# EAGLE design PulseFit (EAGLE 7.3.0)
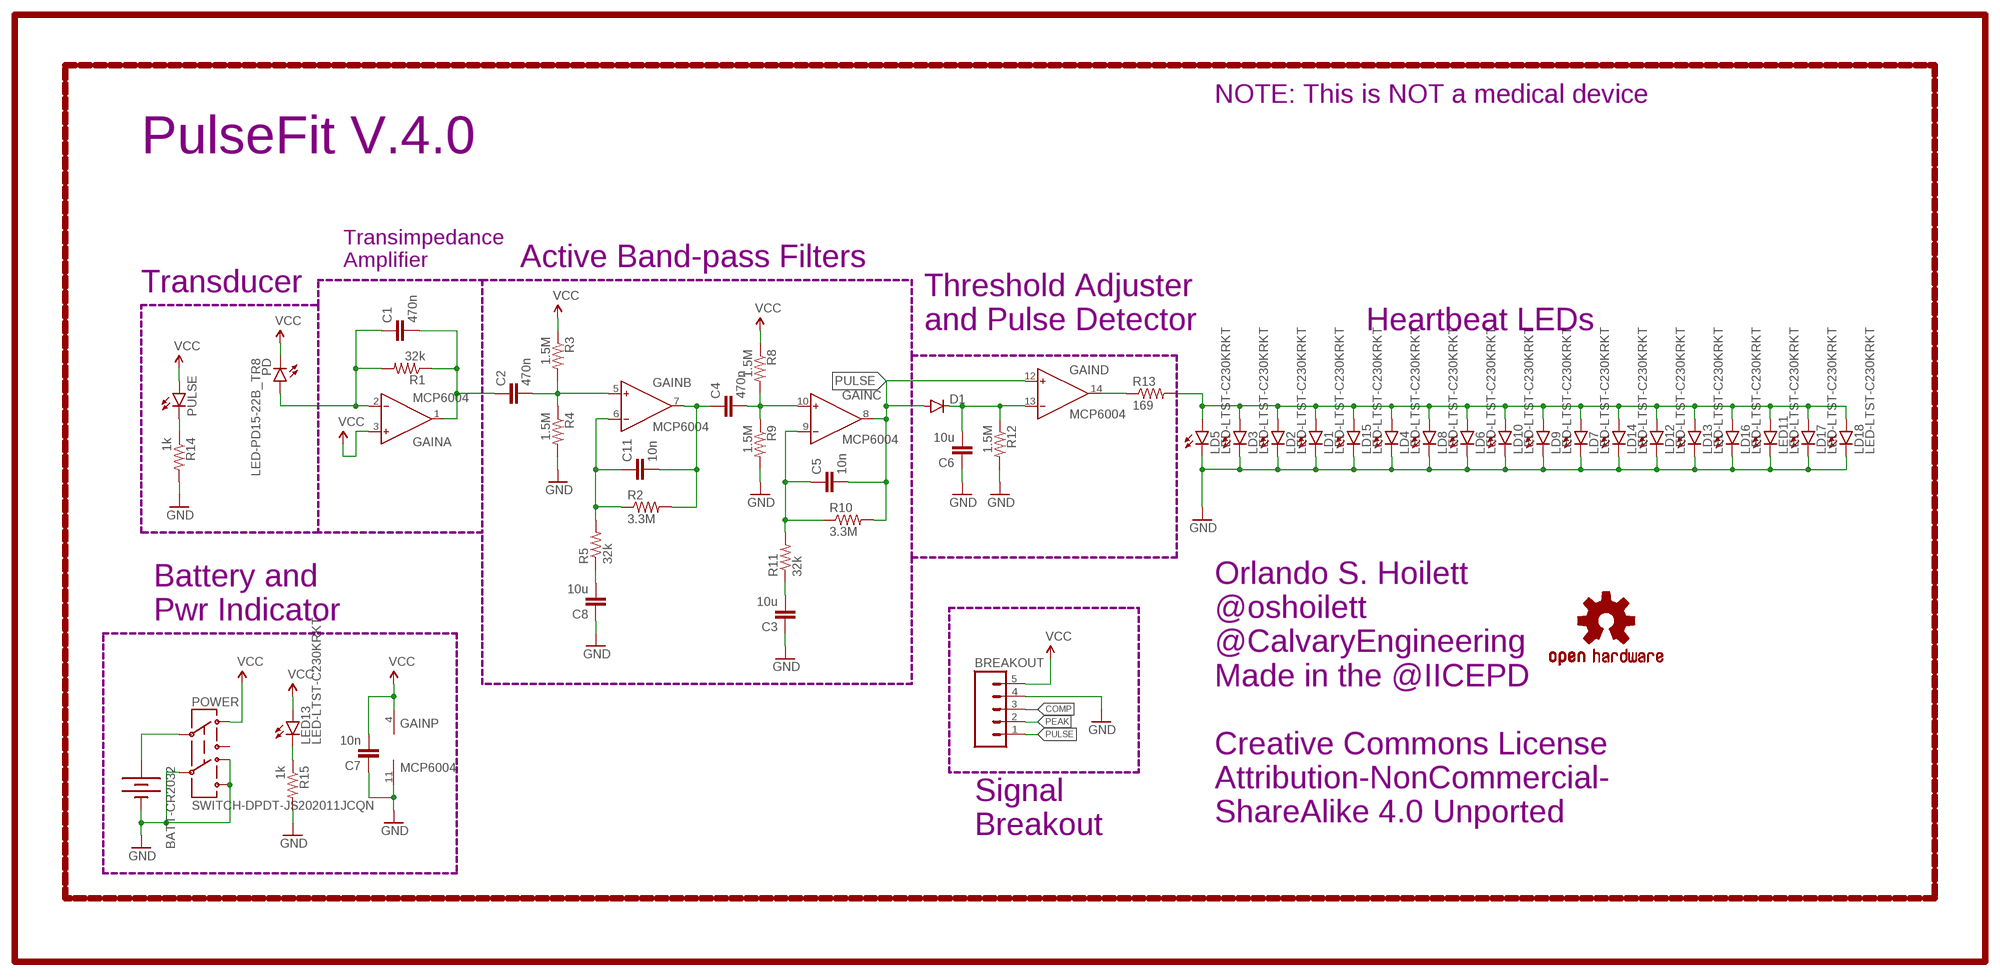
[diagram p0: schematic, sheet 1]

## Parts
BATT-CR2032  BATTERY20SMD  [BATTCON_20MM]
BREAKOUT  M05NO_SILK  [1X05_NO_SILK]
C1  470n  C-EUC0402  [C0402]
C2  470n  C-EUC0402  [C0402]
C3  10u  C-EUC0805  [C0805]
C4  470n  C-EUC0402  [C0402]
C5  10n  C-EUC0402  [C0402]
C6  10u  C-EUC0805  [C0805]
C7  10n  C-EUC0402  [C0402]
C8  10u  C-EUC0805  [C0805]
C11  10n  C-EUC0402  [C0402]
D1  250mA/100V  DIODEBAS16  [SOD-323]
GAIN  MCP6004  AD8609RU  [TSSOP14]
LD1  LED-LTST-C230KRKT  [LED-1206-BOTTOM]
LD2  LED-LTST-C230KRKT  [LED-1206-BOTTOM]
LD3  LED-LTST-C230KRKT  [LED-1206-BOTTOM]
LD4  LED-LTST-C230KRKT  [LED-1206-BOTTOM]
LD5  LED-LTST-C230KRKT  [LED-1206-BOTTOM]
LD6  LED-LTST-C230KRKT  [LED-1206-BOTTOM]
LD7  LED-LTST-C230KRKT  [LED-1206-BOTTOM]
LD8  LED-LTST-C230KRKT  [LED-1206-BOTTOM]
LD9  LED-LTST-C230KRKT  [LED-1206-BOTTOM]
LD10  LED-LTST-C230KRKT  [LED-1206-BOTTOM]
LD12  LED-LTST-C230KRKT  [LED-1206-BOTTOM]
LD13  LED-LTST-C230KRKT  [LED-1206-BOTTOM]
LD14  LED-LTST-C230KRKT  [LED-1206-BOTTOM]
LD15  LED-LTST-C230KRKT  [LED-1206-BOTTOM]
LD16  LED-LTST-C230KRKT  [LED-1206-BOTTOM]
LD17  LED-LTST-C230KRKT  [LED-1206-BOTTOM]
LD18  LED-LTST-C230KRKT  [LED-1206-BOTTOM]
LED11  LED-LTST-C230KRKT  [LED-1206-BOTTOM]
LED13  LED-LTST-C230KRKT  [LED-1206-BOTTOM]
LOGO1  OSHW-LOGOS  [OSHW-LOGO-S]
PD  LED-PD15-22B_TR8  [LED-PD15-22B_TR8]
POWER  SWITCH-DPDT-JS202011JCQN  [J-LEAD]
PULSE  LED0603  [LED-0603]
R1  32k  R-US_R0402  [R0402]
R2  3.3M  R-US_R0402  [R0402]
R3  1.5M  R-US_R0402  [R0402]
R4  1.5M  R-US_R0402  [R0402]
R5  32k  R-US_R0402  [R0402]
R8  1.5M  R-US_R0402  [R0402]
R9  1.5M  R-US_R0402  [R0402]
R10  3.3M  R-US_R0402  [R0402]
R11  32k  R-US_R0402  [R0402]
R12  1.5M  R-US_R0402  [R0402]
R13  169  R-US_R0402  [R0402]
R14  1k  R-US_R0402  [R0402]
R15  1k  R-US_R0402  [R0402]

## Nets
ANODE: LD1.A LD2.A LD3.A LD4.A LD5.A LD6.A LD7.A LD8.A LD9.A LD10.A LD12.A LD13.A LD14.A LD15.A LD16.A LD17.A LD18.A LED11.A R13.2
COMP: BREAKOUT.3 GAIN.14(D:OUT) R13.1
GND: BATT-CR2032.2(-) BREAKOUT.4 C3.1 C6.1 C7.1 C8.1 GAIN.11(P:V-) LD1.C LD2.C LD3.C LD4.C LD5.C LD6.C LD7.C LD8.C LD9.C LD10.C LD12.C LD13.C LD14.C LD15.C LD16.C LD17.C LD18.C LED11.C POWER.4 POWER.5 POWER.6 R4.2 R9.2 R12.2 R14.2 R15.2
N$1: C1.1 GAIN.2(A:IN-) PD.A-1(A) PD.A-2(A) R1.2
N$2: C1.2 C2.1 GAIN.1(A:OUT) R1.1
N$3: C4.2 GAIN.10(C:IN+) R8.2 R9.1
N$4: C2.2 GAIN.5(B:IN+) R3.2 R4.1
N$5: BATT-CR2032.1(+) POWER.2
N$6: C3.2 R11.1
N$8: C5.1 GAIN.9(C:IN-) R10.1 R11.2
N$9: PULSE.C R14.1
N$10: C11.1 GAIN.6(B:IN-) R2.1 R5.2
N$11: C4.1 C11.2 GAIN.7(B:OUT) R2.2
N$12: LED13.C R15.1
N$14: C8.2 R5.1
PEAK: BREAKOUT.2 C6.2 D1.C GAIN.13(D:IN-) R12.1
PULSE: BREAKOUT.1 C5.2 D1.A GAIN.8(C:OUT) GAIN.12(D:IN+) R10.2
VCC: BREAKOUT.5 C7.2 GAIN.3(A:IN+) GAIN.4(P:V+) LED13.A PD.C-1(C) PD.C-2(C) POWER.1 PULSE.A R3.1 R8.1
Unconnected: POWER.3

## Notes on the sheet
- NOTE: This is NOT a medical device
- PulseFit V.4.0
- Transimpedance
  Amplifier
- Active Band-pass Filters
- Transducer
- Threshold Adjuster
  and Pulse Detector
- Heartbeat LEDs
- Battery and
  Pwr Indicator
- Orlando S. Hoilett
  @oshoilett
  @CalvaryEngineering
  Made in the @IICEPD
  
  Creative Commons License
  Attribution-NonCommercial-
  ShareAlike 4.0 Unported
- Signal
  Breakout

## Library data of the parts
BATT-CR2032 = SparkFun-Electromechanical:BATTERY: Battery Holders Various common sizes : AA, AAA, 18650 (PRT-12895), 20mm coin cell and 12mm coin cell. 20MM_4LEGS, BATT-10373
BREAKOUT = SparkFun-Connectors:M05: Header 5 Standard 5-pin 0.1" header. Use with straight break away headers (SKU : PRT-00116), right angle break away headers (PRT-00553), swiss pins (PRT-00743), machine pins (PRT-00117), and female headers (PRT-00115). Molex polarized connector foot print use with SKU : PRT-08230 with associated crimp pins and housings.
C1-C8 C11 = resistor:C-EU: CAPACITOR, European symbol
D1 = SparkFun-DiscreteSemi:DIODE: Diode These are standard reverse protection diodes and small signal diodes. SMA package can handle up to about 1A. SOD-323 can handle about 200mA. What the SOD-323 package when ordering, there are some mfgs out there that are 5-pin packages.; PROD_ID: DIO-09646
GAIN = analog-devices:AD8609: Precision Micropower, Low Noise CMOS, Rail-to-Rail Input/Output Operational Amplifiers Source: http://www.analog.com/static/imported-files/data_sheets/AD8603_8607_8609.pdf; MF: ALTERA CORPORATION; MPN: AD8609ARUZ; OC_FARNELL: 1464994; OC_NEWARK: 59K6934
LD1-LD10 LD12-LD18 LED11 LED13 = Orlando:LED-LTST-C230KRKT
LOGO1 = SparkFun-Aesthetics:OSHW-LOGO: Open Source Hardware Logo This logo indicates the piece of hardware it is found on incorporates a OSHW license and/or adheres to the definition of open source hardware found here: http://freedomdefined.org/OSHW
PD = Orlando:LED-PD15-22B_TR8
POWER = SparkFun-Electromechanical:SWITCH-DPDT-JS202011JCQN
PULSE = SparkFun-LED:LED: LEDs Standard schematic elements and footprints for 5mm, 3mm, 1206, and 0603 sized LEDs. 5mm - Spark Fun Electronics SKU : COM-00529 (and others)
R1-R5 R8-R15 = resistor:R-US_: RESISTOR, American symbol

## Board
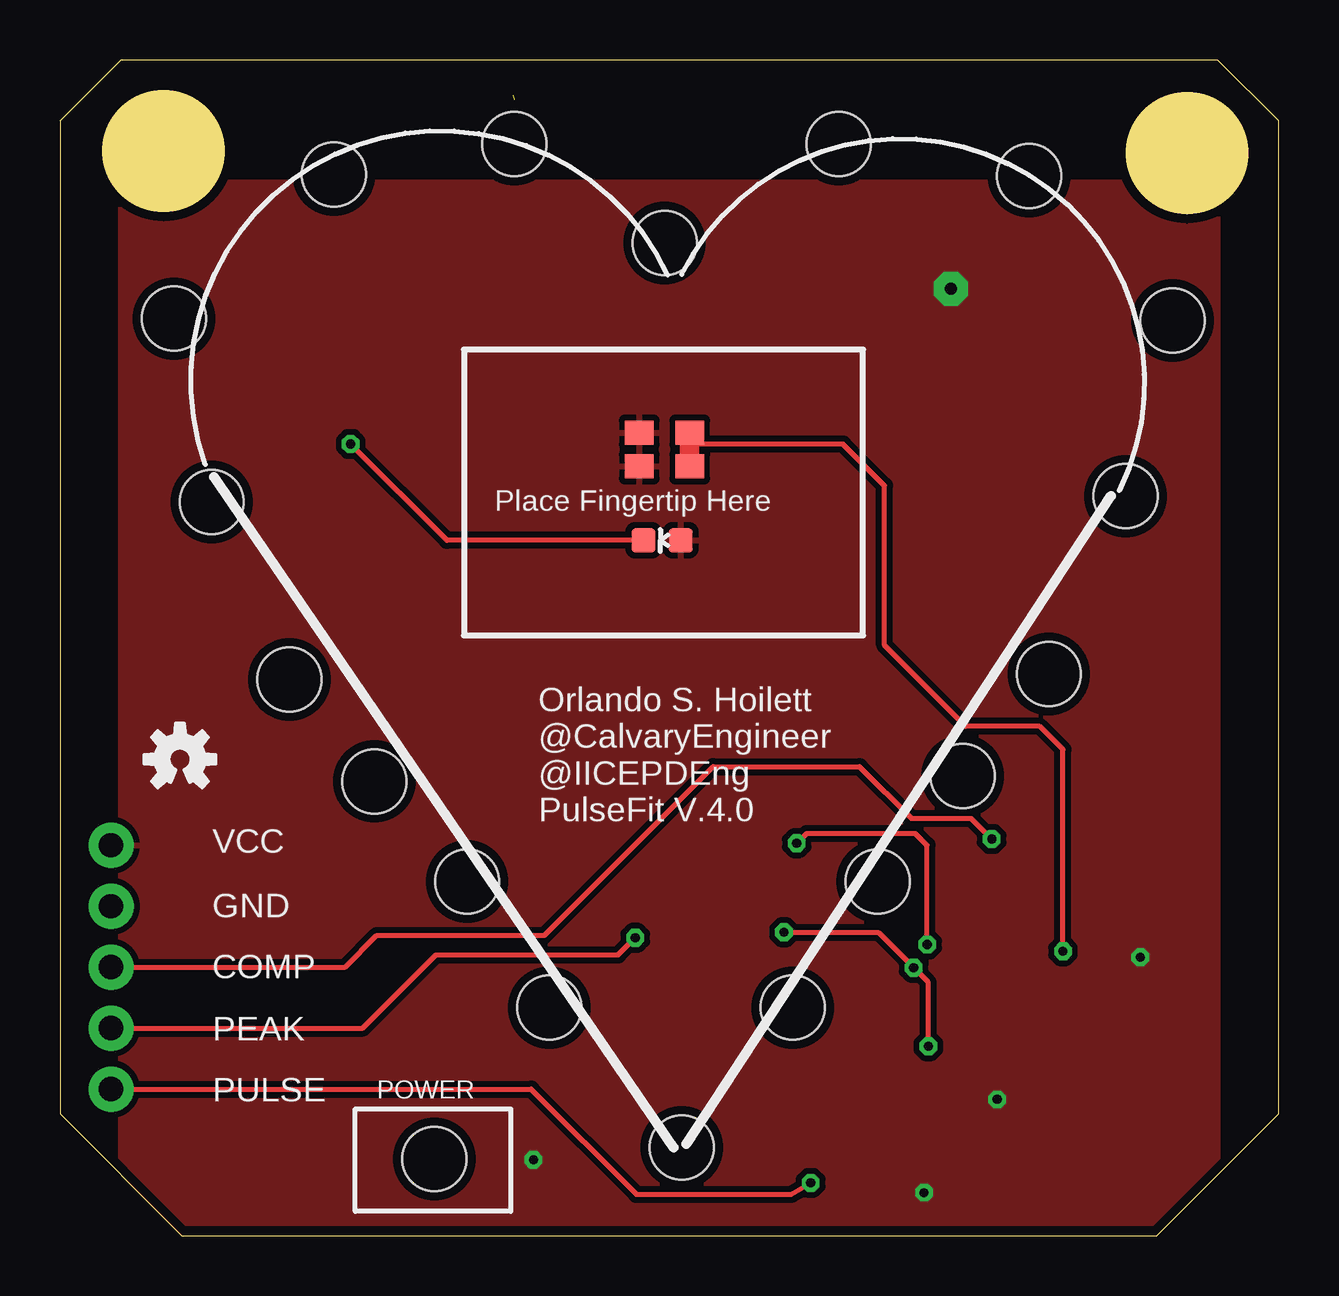
[diagram p1: board, top side]
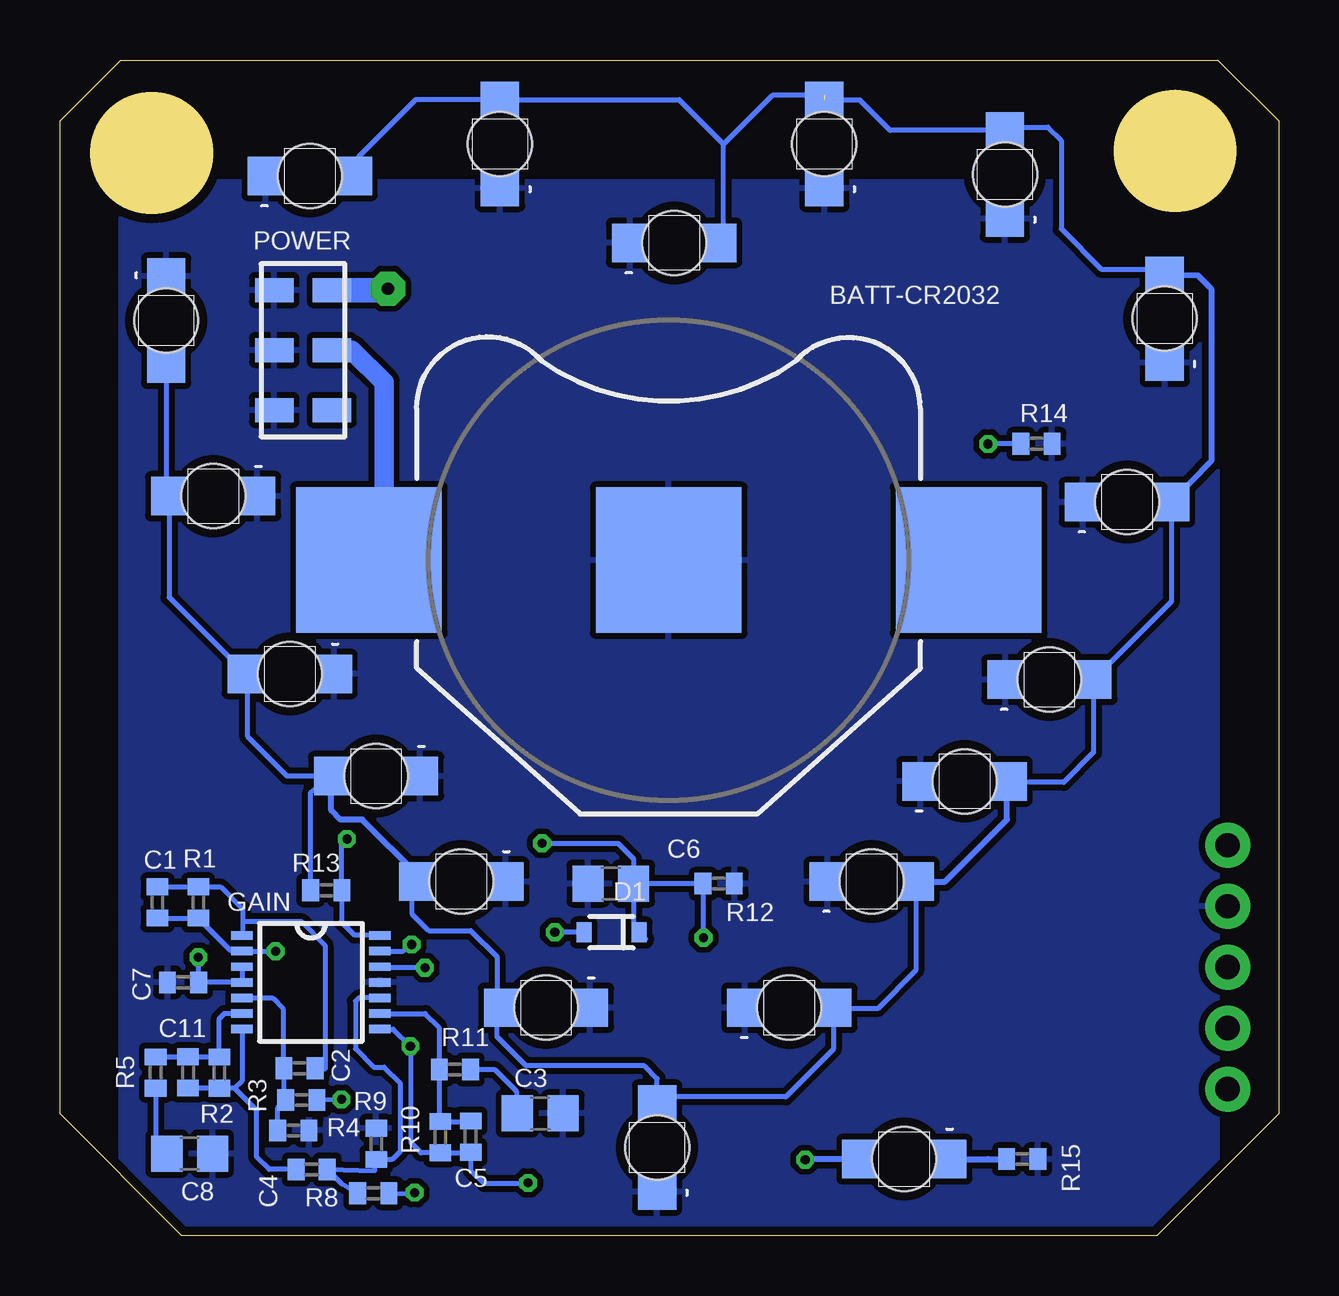
[diagram p2: board, bottom side, seen from below]

Size 50.8 x 49 mm. Coordinates in mm from the lower left corner, seen from the top.
Outline: 4.29,45.21 4.34,45.21
Outline: 46.95,45.12 47,45.12
Outline: 5.08,0 45.72,0 50.8,5.08 50.8,46.46 48.26,49 2.54,49 0,46.46 0,5.08 5.08,0
Copper layers (1*16): Top 0.0356mm / dielectric 1.5011mm / Bottom 0.0356mm
Design rules "LaenPCBOrder": minimum track width 6mil, minimum drill 13mil, track to track 6mil, track to pad 6mil, pad to pad 6mil, via to via 6mil, smd to smd 6mil, copper to edge 15mil, drill to drill 6mil, minimum pad ring 7mil, minimum via ring 7mil, stop-mask expansion 3mil, vias tented up to drill 0mil, thermal gap 10mil

### Footprints (pad centres in the part's own frame; a part is rotated, then mirrored left to right if it is on the bottom)
BATTCON_20MM = smd 6.07 x 6.07: 1 -12.5,0; 2 0,0; 3 12.5,0
1X05_NO_SILK = drill 1.016 pad 1.88: 1 0,0; 2 2.54,0; 3 5.08,0; 4 7.62,0; 5 10.16,0
C0402 = smd 0.7 x 0.9: 1 -0.65,0; 2 0.65,0
C0805 = smd 1.3 x 1.5: 1 -0.95,0; 2 0.95,0
SOD-323 = smd 0.63 x 0.83: A 1.15,0; C -1.15,0
TSSOP14 = smd 0.9 x 0.35: 1 -2.875,1.95; 2 -2.875,1.3; 3 -2.875,0.65; 4 -2.875,0; 5 -2.875,-0.65; 6 -2.875,-1.3; 7 -2.875,-1.95; 8 2.875,-1.95; 9 2.875,-1.3; 10 2.875,-0.65; 11 2.875,0; 12 2.875,0.65; 13 2.875,1.3; 14 2.875,1.95
LED-1206-BOTTOM = smd 1.5 x 1.6: A -1.841,0; C 1.841,0 | hole 2.667: 0,0
LED-PD15-22B_TR8 = smd 1.2 x 1: A-1 -1.05,0.7; A-2 -1.05,-0.7; C-1 1.05,0.7; C-2 1.05,-0.7
J-LEAD = smd 1 x 1.6: 1 -2.5,1.2; 2 0,1.2; 3 2.5,1.2; 4 -2.5,-1.2; 5 0,-1.2; 6 2.5,-1.2
LED-0603 = smd 1 x 1: A 0,-0.677; C 0,0.877
R0402 = smd 0.7 x 0.9: 1 -0.65,0; 2 0.65,0

### Placement (x,y rotation side)
BATT-CR2032  25.43,28.16 0 bottom
BREAKOUT  2.13,6.12 90 top
C1  1uF  [C0402]  46.74,13.89 90 bottom
C2  1u  [C0402]  40.82,6.99 180 bottom
C3  30.78,5.11 180 bottom
C4  1u  [C0402]  40.31,2.77 0 bottom
C5  33.68,4.14 270 bottom
C6  27.84,14.68 0 bottom
C7  45.67,10.57 0 bottom
C8  45.39,3.43 180 bottom
C11  45.46,6.81 270 bottom
D1  27.81,12.65 180 bottom
GAIN  40.34,10.57 0 bottom
LD1  25.2,41.38 180 bottom
LD2  32.46,45.5 270 bottom
LD3  40.39,44.16 180 bottom
LD4  46.37,38.14 90 bottom
LD5  44.41,30.82 0 bottom
LD6  41.22,23.41 0 bottom
LD7  37.62,19.16 0 bottom
LD8  34.08,14.77 0 bottom
LD9  30.54,9.51 0 bottom
LD10  25.91,3.68 270 bottom
LD12  16.97,14.77 180 bottom
LD13  13.1,18.94 180 bottom
LD14  9.56,23.18 180 bottom
LD15  6.32,30.58 180 bottom
LD16  4.75,38.22 270 bottom
LD17  11.41,44.23 270 bottom
LD18  18.94,45.5 270 bottom
LED11  20.4,9.51 180 bottom
LED13  15.61,3.2 0 bottom
LOGO1  5,19.86 0 top
PD  25.2,32.77 180 top
POWER  40.67,36.91 270 bottom
PULSE  25.2,28.98 90 top
R1  45.03,13.89 270 bottom
R2  44.16,6.8 270 bottom
R3  40.74,5.66 180 bottom
R4  41.07,4.39 0 bottom
R5  46.81,6.81 90 bottom
R8  37.74,1.78 180 bottom
R9  37.62,3.84 90 bottom
R10  34.95,4.11 270 bottom
R11  34.34,6.93 180 bottom
R12  23.34,14.68 0 bottom
R13  39.7,14.4 180 bottom
R14  10.1,33.01 0 bottom
R15  10.69,3.2 0 bottom

### Tracks (layer width: path | path; a pad name or v marks a point on that pad's centre or on a via)
ANODE  (1 unrouted)
  Bottom 0.203: R13.2 40.35,18.48 LD7.A 41.33,19.16 42.98,20.8 42.98,22.71 43.02,22.75 | 23.11,41.38 LD1.A 23.14,41.39 23.14,45.49 | LD13.A 11,18.9 8.97,18.9 7.72,20.14 LD14.A 4.48,26.42 LD15.A | LED11.A 18.31,9.47 16.71,9.47 15.13,11.06 LD12.A | 18.57,9.48 18.57,7.77 20.55,5.79 25.85,5.79 LD10.A 25.91,6.56 26.44,7.09 31.37,7.09 32.59,8.31 32.59,9.51 LD9.A | 32.26,9.59 LD9.A | LD8.A 36.12,14.61 36.12,13.41 35.43,12.72 33.68,12.72 32.59,11.63 32.59,9.51 LD9.A | LD4.A 46.37,30.91 LD5.A 46.25,26.61 LD6.A | LD16.A 4.76,40.27 7.39,40.27 9.07,41.96 9.07,45.65 9.62,46.2 11.34,46.2 LD17.A 16.2,46.07 17.45,47.32 18.92,47.32 LD18.A | LD3.A 38.35,44.18 38.35,44.96 35.97,47.34 LD2.A 24.99,47.34 23.14,45.49 | 18.91,47.52 21.11,47.52 23.14,45.49
  Bottom 0.254: LD6.A 43.02,22.75 | LD12.A 13.91,14.77 11.33,17.35 11.33,18.91 LD13.A 11.25,18.9 | LD16.A 3.37,40.02 2.82,39.47 2.82,32.28 LD15.A | 23.39,41.38 LD1.A | 18.57,9.48 LED11.A | LD8.A 35.88,15.02 38.2,17.35 39.12,17.35 39.5,17.73 39.5,19.09 LD7.A
COMP  (via drill 0.38)
  Top 0.203: BREAKOUT.3 11.88,11.2 13.21,12.52 20.19,12.52 27.23,19.56 33.33,19.56 35.48,17.4 37.97,17.4 v38.84,16.54
  Bottom 0.203: GAIN.14 37.49,12.55 38.53,12.55 39.05,13.07 R13.1 39.05,16.32 v38.84,16.54
GND
  pour Bottom (isolate 0.254): 48.26,43.92 48.26,0.51 2.54,0.51 2.54,43.92
N$1  (via drill 0.38)
  Top 0.203: v41.81,11.86 41.81,20.27 40.84,21.23 37.74,21.23 34.37,24.61 34.37,31.27 32.64,32.99 26.72,32.99 PD.A-2 | 26.32,33.05 26.25,32.97
  Top 0.813: PD.A-2 26.25,32.97 PD.A-1
  Bottom 0.203: 45.14,13.14 R1.2 | C1.1 R1.2 | v41.81,11.86 v41.81,11.87 GAIN.2 43.66,11.87 R1.2
N$2
  Bottom 0.203: 43.18,13.03 43.18,13.61 44.11,14.54 R1.1 C1.2 | 43.18,13.03 43.18,12.55 GAIN.1 | C2.1 39.75,6.95 39.75,12.12 40.72,13.08 43.13,13.08 43.18,13.03
N$3
  Bottom 0.203: R8.2 39.05,2.16 C4.2 37.68,2.72 R9.1 37.61,3.17 36.96,3.17 36.63,3.5 36.63,6.38 37.29,7.04 37.72,7.04 38.48,7.8 38.48,9.78 38.34,9.92 GAIN.10
N$4
  Bottom 0.203: GAIN.5 41.95,9.92 41.5,9.47 41.5,7.02 C2.2 41.47,5.74 R3.2 41.72,5.33 R4.1
N$5
  Bottom 0.813: POWER.2 38.63,36.91 37.29,35.56 37.29,28.8 BATT-CR2032.1
N$6
  Bottom 0.203: R11.1 32.69,6.93 31.77,6.02 31.77,5.15 C3.2
N$8
  Bottom 0.203: R10.1 33.71,4.76 C5.1 | GAIN.9 35.58,9.27 35,8.69 35,6.95 R11.2 34.99,4.8 R10.1 | 35,4.82 R10.1
N$9  (via drill 0.38)
  Top 0.203: PULSE.C 16.13,28.98 v12.12,32.99
  Bottom 0.203: R14.1 12.1,33.01 v12.12,32.99
N$10
  Bottom 0.203: GAIN.6 43.94,9.27 44.16,9.06 R2.1 C11.1 | C11.1 | C11.1 R5.2
N$11
  Bottom 0.203: GAIN.7 43.21,6.45 43.51,6.15 | 43.51,6.15 44.15,6.15 R2.2 C11.2 | C4.1 42.09,2.77 42.6,3.28 42.6,5.23 43.51,6.15
N$12
  Bottom 0.254: LED13.C 12.11,3.2 R15.1
N$14
  Bottom 0.203: R5.1 46.81,3.9 C8.2
PEAK  (via drill 0.38)
  Top 0.203: v36.14,12.14 36.14,16.28 35.66,16.76 31.12,16.76 v30.71,16.36 | BREAKOUT.2 12.62,8.66 15.67,11.71 23.27,11.71 v23.98,12.42
  Top 0.254: 2.15,8.64 BREAKOUT.2
  Bottom 0.203: C6.2 26.89,12.88 D1.C 26.38,12.37 | GAIN.13 36.5,11.87 v36.14,12.14 | C6.2 R12.1 23.98,14.67 v23.98,12.42 | v30.71,16.36 27.53,16.36 26.9,15.72 26.9,14.69 C6.2
PULSE  (via drill 0.38)
  Top 0.203: v36.2,7.9 36.2,10.57 v35.59,11.18 34.11,12.65 v30.18,12.65 | BREAKOUT.1 19.64,6.12 24.03,1.73 30.48,1.73 v31.29,2.21
  Bottom 0.203: GAIN.8 36.91,8.62 v36.2,7.9 36.17,7.87 36.17,3.89 35.75,3.46 R10.2 33.71,3.46 C5.2 33.68,2.74 33.12,2.18 31.32,2.18 v31.29,2.21 | v35.59,11.18 37.42,11.18 GAIN.12 | D1.A v30.18,12.65
VCC  (via drill 0.38, 0.51 pad 1.42)
  Bottom 0.203: R8.1 36.07,1.75 v36.02,1.8 | GAIN.3 GAIN.4 C7.2 45.02,11.09 v45.03,11.61 | R3.1 v39.07,5.69
  Bottom 0.254: LED13.A 19.74,3.2 v19.74,3.17
  Bottom 1.016: POWER.1 37.2,39.41 v37.13,39.47
  pour Top (isolate 0.254): 2.54,43.92 48.26,43.92 48.26,0.51 2.54,0.51

### Text on the board
tNames: Orlando S. Hoilett / @CalvaryEngineer / @IICEPDEng / PulseFit V.4.0 | VCC | GND | COMP | PEAK | PULSE | POWER
tplace-old: Creative Commons License / Attribution-NonCommercial- / ShareAlike 3.0 Unported
_tsilk: Place Fingertip Here